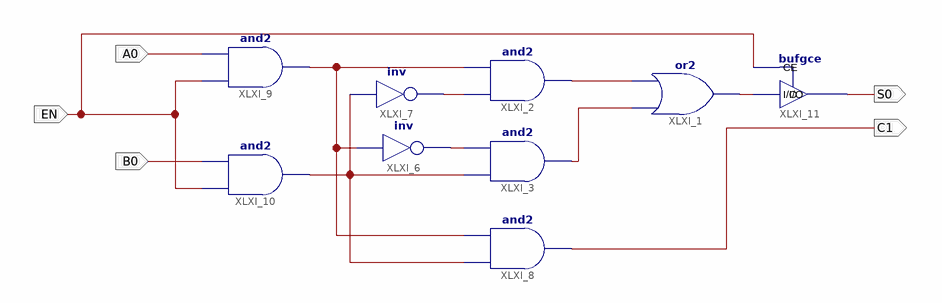
[diagram p0: schematic sheet 1]
// Xilinx ISE schematic my_half_addr.sch (virtex6) as structural Verilog: 9 symbols, 5 ports
module my_half_addr (
  input  A0,
  input  B0,
  input  EN,
  output S0,
  output C1
);

  wire XLXN_1, XLXN_2, XLXN_5, XLXN_6, XLXN_17, XLXN_26;

  or XLXI_1 (S0, XLXN_6, XLXN_5);
  and XLXI_2 (XLXN_5, XLXN_2, XLXN_17);
  and XLXI_3 (XLXN_6, XLXN_26, XLXN_1);
  not XLXI_6 (XLXN_1, XLXN_17);
  and XLXI_8 (C1, XLXN_26, XLXN_17);
  and XLXI_9 (XLXN_17, EN, A0);
  and XLXI_10 (XLXN_26, EN, B0);
  bufgce XLXI_11 (.CE(EN), .I(S0), .O(S0));
  not XLXI_7 (XLXN_2, XLXN_26);
endmodule
